# EAGLE design LayerOne_2017 (EAGLE 7.7.0)
Assembly variants: L4

## Sheet 1 of 8
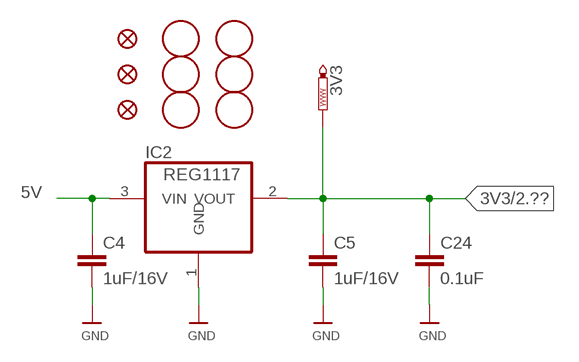
[diagram p0: schematic, sheet 1]

### Parts
3V3  PTR1PAD1-13  [P1-13]
C4  1uF/16V  CAP0805  [0805]
C5  1uF/16V  CAP0805  [0805]
C24  0.1uF  CAP0805  [0805]
FID1  FIDUCIALROUND  [PASS-ROUND]
FID2  FIDUCIALROUND  [PASS-ROUND]
FID3  FIDUCIALROUND  [PASS-ROUND]
IC2  REG1117  [SOT223]
U$3  FIDUCIAL  [FIDUCIAL_1MM]
U$4  FIDUCIAL  [FIDUCIAL_1MM]
U$5  FIDUCIAL  [FIDUCIAL_1MM]
U$7  FIDUCIAL  [FIDUCIAL_1MM]
U$8  FIDUCIAL  [FIDUCIAL_1MM]
U$9  FIDUCIAL  [FIDUCIAL_1MM]

### Nets
3V3: 3V3.TP C5.1 C24.1 IC2.2(VOUT) ; also sheet 2,3,4,5
5V: C4.1 IC2.3(VIN) ; also sheet 2,7,8
GND: C4.2 C5.2 C24.2 IC2.1(GND) ; also sheet 2,3,4,5,6,7,8

## Sheet 2 of 8
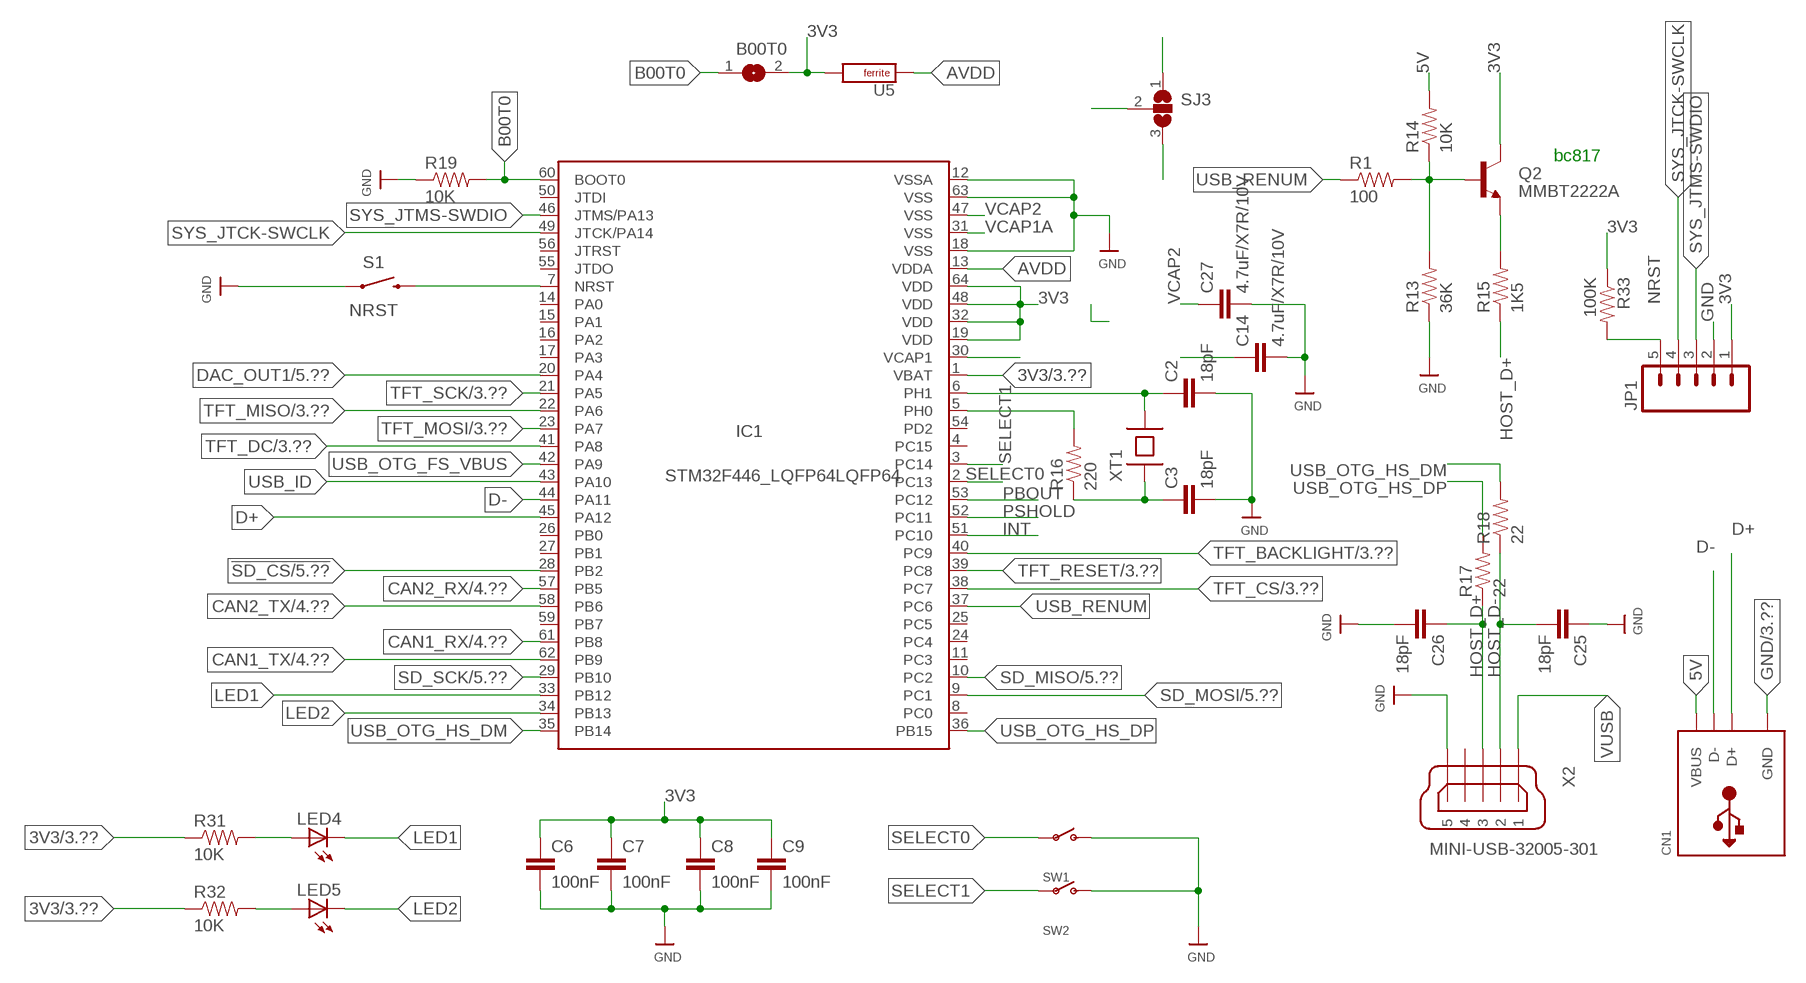
[diagram p1: schematic, sheet 2]

### Parts
B00T0  SJW  [SJW]
C2  18pF  CAP0805  [0805]
C3  18pF  CAP0805  [0805]
C6  100nF  CAP0805  [0805]
C7  100nF  CAP0805  [0805]
C8  100nF  CAP0805  [0805]
C9  100nF  CAP0805  [0805]
C14  4.7uF/X7R/10V  CAP0805  [0805]
C25  18pF  CAP0805  [0805]
C26  18pF  CAP0805  [0805]
C27  4.7uF/X7R/10V  CAP0805  [0805]
CN1  USB_TYPEAPTHFML  [USB_HOST-PTH]
IC1  STM32F446_LQFP64LQFP64  [LQFP64]
JP1  M05PTH  [1X05]
LED4  LEDCHIP-LED0805  [CHIP-LED0805]
LED5  LEDCHIP-LED0805  [CHIP-LED0805]
Q2  MMBT2222A  TRANSISTOR_NPNMMBT2222A  [SOT23]
R1  100  RESISTOR0805-RES  [0805]
R13  36K  RESISTOR0805-RES  [0805]
R14  10K  RESISTOR0805-RES  [0805]
R15  1K5  RESISTOR0805-RES  [0805]
R16  220  RESISTOR0805-RES  [0805]
R17  22  RESISTOR0805-RES  [0805]
R18  22  RESISTOR0805-RES  [0805]
R19  10K  RESISTOR0805-RES  [0805]
R31  10K  RESISTOR0805-RES  [0805]
R32  10K  RESISTOR0805-RES  [0805]
R33  100K  RESISTOR0805-RES  [0805]
S1  SPARKFUN_SWITCH-MOMENTARY-2SMD  [SPARKFUN_TACTILE_SWITCH_SMD]
SJ3  SJ2W  [SJ_2]
SW1  SWITCH_SPST  [SPST_SMT_19192]
SW2  SWITCH_SPST  [SPST_SMT_19192]
U5  FERRITE0805  [RLC_0805]
X2  MINI-USB-32005-301  [32005-301]
XT1  8Mhz/16pF  XTAL-SMD-CITIZEN-CS10  [XTAL-SMD-CITIZEN-CS10]

### Nets
3V3: B00T0.2 C6.1 C7.1 C8.1 C9.1 IC1.1(VBAT) IC1.19(VDD) IC1.32(VDD) IC1.48(VDD) IC1.64(VDD) JP1.1 Q2.3(C) R31.1 R32.1 R33.1 U5.2(B) ; also sheet 1,3,4,5
5V: CN1.VBUS R14.2 ; also sheet 1,7,8
!SD_CS: IC1.28(PB2) ; also sheet 5
AVDD: IC1.13(VDDA) U5.1(A)
B00T0: B00T0.1 IC1.60(BOOT0) R19.2
CAN1_RX: IC1.61(PB8) ; also sheet 4
CAN1_TX: IC1.62(PB9) ; also sheet 4
CAN2_RX: IC1.57(PB5) ; also sheet 4
CAN2_TX: IC1.58(PB6) ; also sheet 4
D+: CN1.D+ IC1.45(PA12)
D-: CN1.D- IC1.44(PA11)
DAC_OUT1: IC1.20(PA4) ; also sheet 5
GND: C2.2 C3.2 C6.2 C7.2 C8.2 C9.2 C14.2 C25.1 C26.2 C27.2 CN1.GND IC1.12(VSSA) IC1.18(VSS) IC1.63(VSS) JP1.2 R13.1 R19.1 S1.1 SW1.C(S) SW2.C(S) X2.5 ; also sheet 1,3,4,5,6,7,8
HOST_D+: C26.1 R15.1 R17.1 X2.3
HOST_D-: C25.2 R18.1 X2.2
INT: IC1.51(PC10) ; also sheet 8
LED1: IC1.33(PB12) LED4.C
LED2: IC1.34(PB13) LED5.C
N$3: Q2.1(B) R1.2 R13.2 R14.1
N$4: Q2.2(E) R15.2
N$10: C2.1 IC1.6(PH1) XT1.B
N$18: C3.1 R16.1 XT1.A
N$19: IC1.5(PH0) R16.2
N$38: LED4.A R31.2
N$39: LED5.A R32.2
NRST: IC1.7(NRST) JP1.5 R33.2 S1.3 ; also sheet 8
PBOUT: IC1.53(PC12) ; also sheet 8
PSHOLD: IC1.52(PC11) ; also sheet 8
SD_MISO: IC1.10(PC2) ; also sheet 5
SD_MOSI: IC1.9(PC1) ; also sheet 5
SD_SCK: IC1.29(PB10) ; also sheet 5
SELECT0: IC1.2(PC13) SW1.B(P)
SELECT1: IC1.3(PC14) SW2.B(P)
SYS_JTCK-SWCLK: IC1.49(JTCK/PA14) JP1.4
SYS_JTMS-SWDIO: IC1.46(JTMS/PA13) JP1.3
TFT_BACKLIGHT: IC1.40(PC9) ; also sheet 3
TFT_CS: IC1.38(PC7) ; also sheet 3
TFT_DC: IC1.41(PA8) ; also sheet 3
TFT_MISO: IC1.22(PA6) ; also sheet 3
TFT_MOSI: IC1.23(PA7) ; also sheet 3
TFT_RESET: IC1.39(PC8) ; also sheet 3
TFT_SCK: IC1.21(PA5) ; also sheet 3
USB_ID: IC1.43(PA10)
USB_OTG_FS_VBUS: IC1.42(PA9)
USB_OTG_HS_DM: IC1.35(PB14) R18.2
USB_OTG_HS_DP: IC1.36(PB15) R17.2
USB_RENUM: IC1.37(PC6) R1.1
VCAP1: IC1.30(VCAP1) SJ3.1
VCAP1A: IC1.31(VSS) SJ3.3
VCAP1C: C14.1 SJ3.2
VCAP2: C27.1 IC1.47(VSS)
VUSB: X2.1 ; also sheet 6
Unconnected: IC1.4(PC15) IC1.8(PC0) IC1.11(PC3) IC1.14(PA0) IC1.15(PA1) IC1.16(PA2) IC1.17(PA3) IC1.24(PC4) IC1.25(PC5) IC1.26(PB0) IC1.27(PB1) IC1.50(JTDI) IC1.54(PD2) IC1.55(JTDO) IC1.56(JTRST) IC1.59(PB7) X2.4

### Notes on the sheet
- bc817

## Sheet 3 of 8
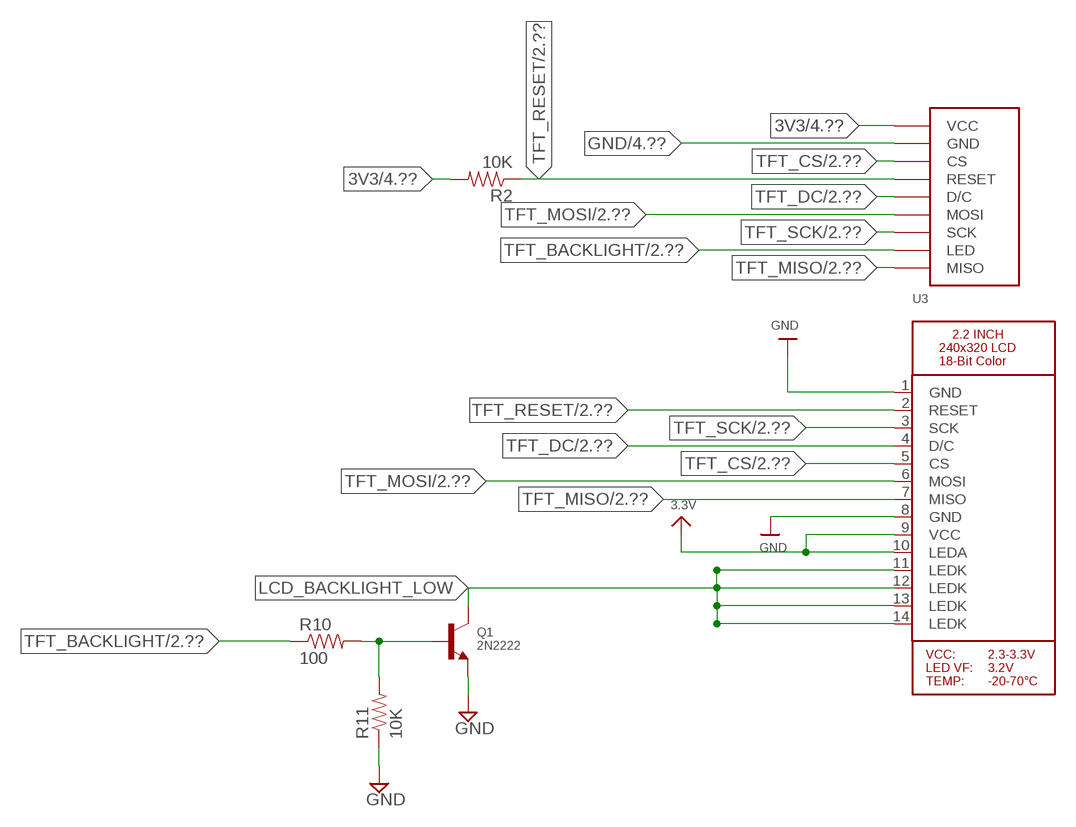
[diagram p2: schematic, sheet 3]

### Parts
J1  SPI_TFT_DISPLAY  [SPI_DISPLAY]
Q1  2N2222  TRANSISTOR_NPNWIDE  [SOT23-WIDE]
R2  10K  RESISTOR0805-RES  [0805]
R10  100  RESISTOR0805-RES  [0805]
R11  10K  RESISTOR0805-RES  [0805]
U3  MICROBUILDER_DISP_LCD_TM022HDH26  [MICROBUILDER_TM022HDH26_2.2IN_LCD]

### Nets
3V3: J1.VCC R2.2 U3.9(VCC) U3.10(LEDA) ; supply symbol labelled 3.3V ; also sheet 1,2,4,5
GND: J1.GND Q1.2(E) R11.1 U3.1(GND) U3.8(GND) ; also sheet 1,2,4,5,6,7,8
LCD_BACKLIGHT_LOW: Q1.3(C) U3.11(LEDK) U3.12(LEDK) U3.13(LEDK) U3.14(LEDK)
N$16: Q1.1(B) R10.2 R11.2
TFT_BACKLIGHT: J1.LED R10.1 ; also sheet 2
TFT_CS: J1.CS U3.5(CS) ; also sheet 2
TFT_DC: J1.D/C U3.4(D/C) ; also sheet 2
TFT_MISO: J1.MISO U3.7(MISO) ; also sheet 2
TFT_MOSI: J1.MOSI U3.6(MOSI) ; also sheet 2
TFT_RESET: J1.RESET R2.1 U3.2(RESET) ; also sheet 2
TFT_SCK: J1.SCK U3.3(SCK) ; also sheet 2

## Sheet 4 of 8
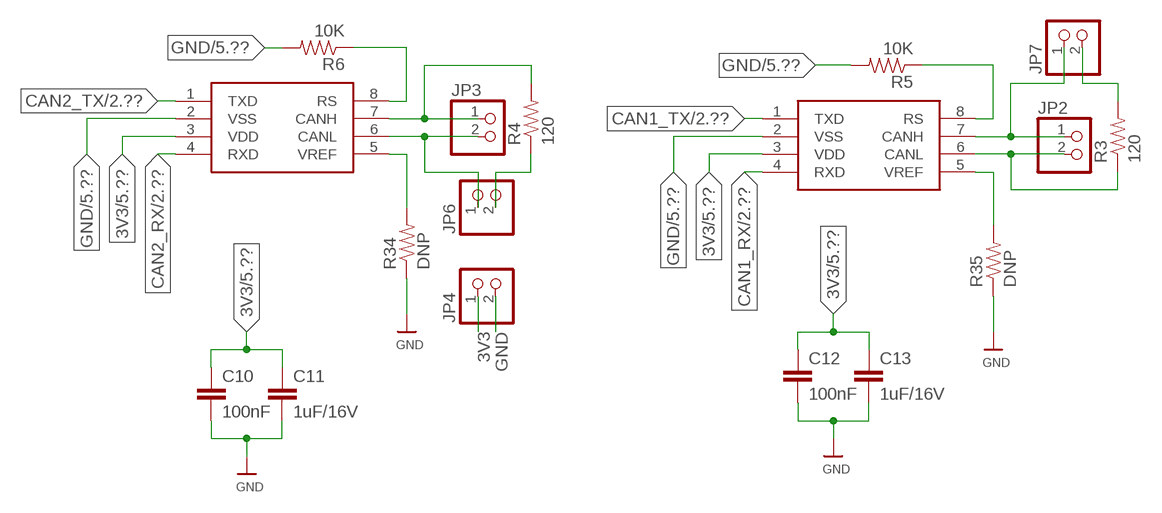
[diagram p3: schematic, sheet 4]

### Parts
C10  100nF  CAP0805  [0805]
C11  1uF/16V  CAP0805  [0805]
C12  100nF  CAP0805  [0805]
C13  1uF/16V  CAP0805  [0805]
JP2  HEADER-1X2  [1X02_OVAL]
JP3  HEADER-1X2  [1X02_OVAL]
JP4  HEADER-1X2  [1X02_OVAL]
JP6  HEADER-1X2  [1X02_OVAL]
JP7  HEADER-1X2  [1X02_OVAL]
R3  120  RESISTOR0805-RES  [0805]
R4  120  RESISTOR0805-RES  [0805]
R5  10K  RESISTOR0805-RES  [0805]
R6  10K  RESISTOR0805-RES  [0805]
R34  DNP  RESISTOR0805-RES  [0805]
R35  DNP  RESISTOR0805-RES  [0805]
U1  SN65HVD235DR  MCP2551  [SO08]
U2  SN65HVD235DR  MCP2551  [SO08]

### Nets
3V3: C10.1 C11.1 C12.1 C13.1 JP4.1 U1.3(VDD) U2.3(VDD) ; also sheet 1,2,3,5
CAN1_RX: U2.4(RXD) ; also sheet 2
CAN1_TX: U2.1(TXD) ; also sheet 2
CAN2_RX: U1.4(RXD) ; also sheet 2
CAN2_TX: U1.1(TXD) ; also sheet 2
CANH1: JP2.1 JP7.1 U2.7(CANH)
CANH2: JP3.1 R4.2 U1.7(CANH)
CANL1: JP2.2 R3.1 U2.6(CANL)
CANL2: JP3.2 JP6.1 U1.6(CANL)
GND: C10.2 C11.2 C12.2 C13.2 JP4.2 R5.2 R6.2 R34.1 R35.1 U1.2(VSS) U2.2(VSS) ; also sheet 1,2,3,5,6,7,8
N$6: JP7.2 R3.2
N$22: JP6.2 R4.1
N$30: R34.2 U1.5(VREF)
N$41: R35.2 U2.5(VREF)
SLOPE1: R5.1 U2.8(RS)
SLOPE2: R6.1 U1.8(RS)

## Sheet 5 of 8
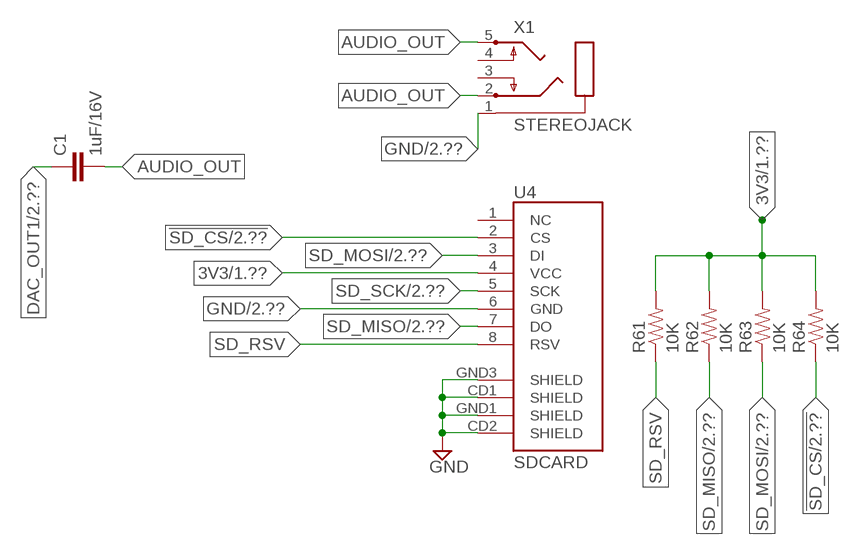
[diagram p4: schematic, sheet 5]

### Parts
C1  1uF/16V  CAP0805  [0805]
R61  10K  RESISTOR0805-RES  [0805]
R62  10K  RESISTOR0805-RES  [0805]
R63  10K  RESISTOR0805-RES  [0805]
R64  10K  RESISTOR0805-RES  [0805]
U4  SDCARD  USD-SOCKETNEW  [MICRO-SD-SOCKET-PP]
X1  STEREOJACK  [STX3100]

### Nets
3V3: R61.2 R62.2 R63.2 R64.2 U4.4(VCC) ; also sheet 1,2,3,4
!SD_CS: R64.1 U4.2(CS) ; also sheet 2
AUDIO_OUT: C1.2 X1.2 X1.5
DAC_OUT1: C1.1 ; also sheet 2
GND: U4.6(GND) U4.CD1(SHIELD) U4.CD2(SHIELD) U4.GND1(SHIELD) U4.GND3(SHIELD) X1.1 ; also sheet 1,2,3,4,6,7,8
SD_MISO: R62.1 U4.7(DO) ; also sheet 2
SD_MOSI: R63.1 U4.3(DI) ; also sheet 2
SD_RSV: R61.1 U4.8(RSV)
SD_SCK: U4.5(SCK) ; also sheet 2
Unconnected: U4.1(NC) X1.3 X1.4

## Sheet 6 of 8
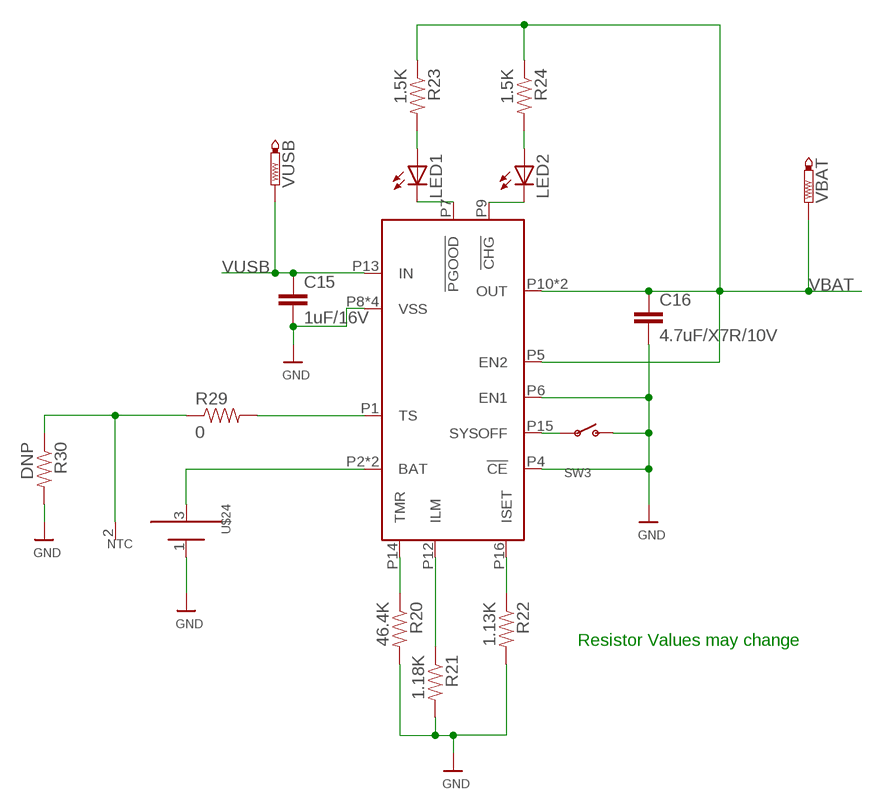
[diagram p5: schematic, sheet 6]

### Parts
C15  1uF/16V  CAP0805  [0805]
C16  4.7uF/X7R/10V  CAP0805  [0805]
LED1  LEDCHIPLED_0603  [CHIPLED_0603]
LED2  LEDCHIPLED_0603  [CHIPLED_0603]
R20  46.4K  RESISTOR0805-RES  [0805]
R21  1.18K  RESISTOR0805-RES  [0805]
R22  1.13K  RESISTOR0805-RES  [0805]
R23  1.5K  RESISTOR0805-RES  [0805]
R24  1.5K  RESISTOR0805-RES  [0805]
R29  0  RESISTOR0805-RES  [0805]
R30  DNP  RESISTOR0805-RES  [0805]
SW3  SWITCH_SPST  [SPST_SMT_19192]
U$23  TI-BQ2407XBQ24075  [QFN16]
U$24  BATT  [BATT]
VBAT  PTR1PAD1-13  [P1-13]
VUSB  PTR1PAD1-13  [P1-13]

### Nets
GND: C15.2 C16.2 R20.2 R21.2 R22.2 R30.2 SW3.C(S) U$23.P4(!CE) U$23.P6(EN1) U$23.P8(VSS) U$23.XPAD@1(VSS) U$23.XPAD@2(VSS) U$23.XPAD@3(VSS) U$24.1(NEG) ; also sheet 1,2,3,4,5,7,8
N$17: R29.2 U$23.P1(TS)
N$24: U$23.P2(BAT) U$23.P3(BAT) U$24.3(POS)
N$25: LED1.C U$23.P7(!PGOOD)
N$29: LED1.A R23.2
N$31: SW3.B(P) U$23.P15(SYSOFF)
N$32: R20.1 U$23.P14(TMR)
N$33: R21.1 U$23.P12(ILM)
N$34: R22.1 U$23.P16(ISET)
N$35: LED2.C U$23.P9(!CHG)
N$36: LED2.A R24.2
N$37: R29.1 R30.1 U$24.2(NTC)
VBAT: C16.1 R23.1 R24.1 U$23.P5(EN2) U$23.P10(OUT) U$23.P11(OUT) VBAT.TP ; also sheet 7,8
VUSB: C15.1 U$23.P13(IN) VUSB.TP ; also sheet 2

### Notes on the sheet
- Resistor Values may change

## Sheet 7 of 8
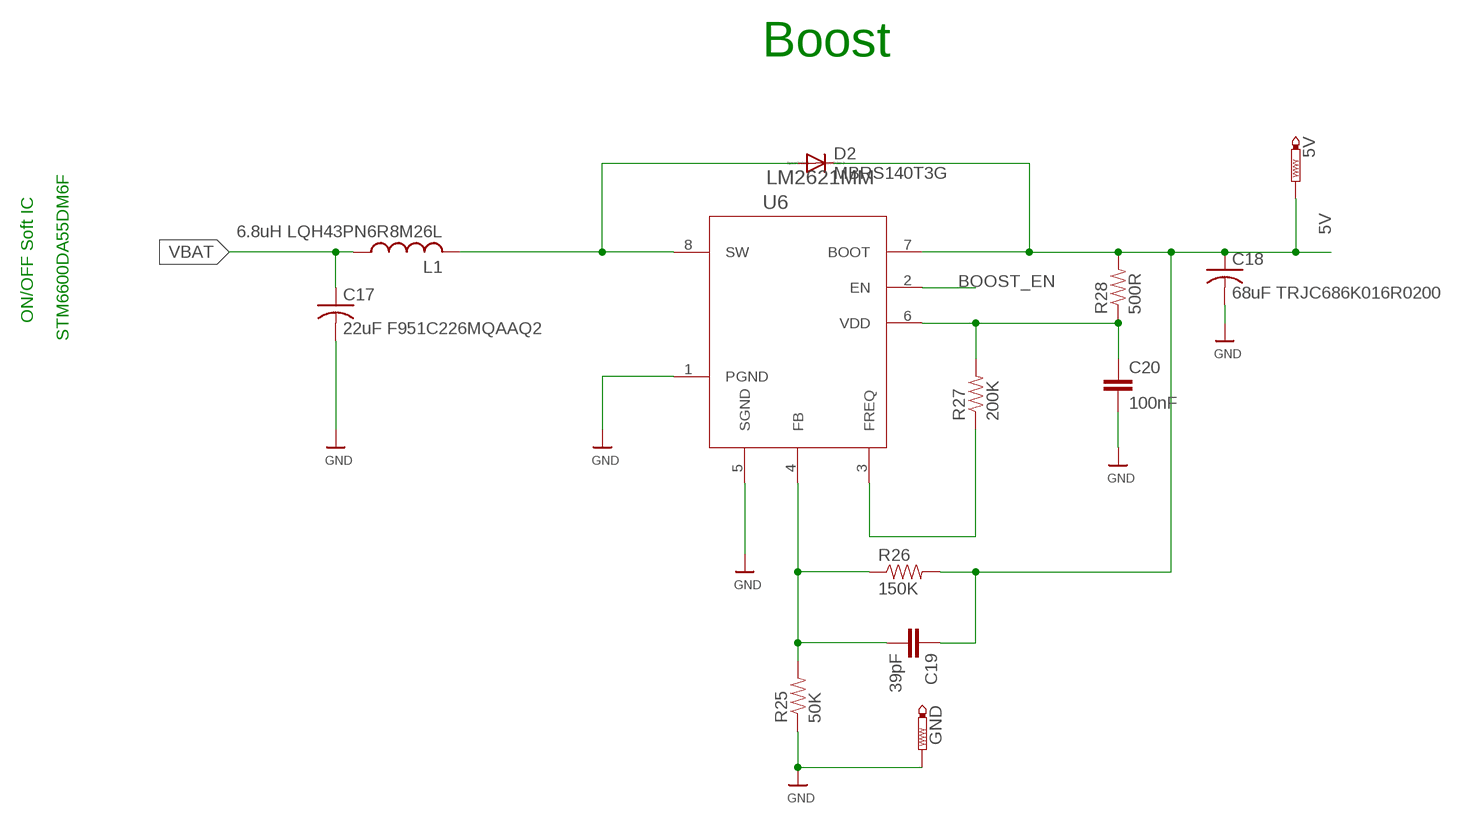
[diagram p6: schematic, sheet 7]

### Parts
5V  PTR1PAD1-13  [P1-13]
C17  22uF F951C226MQAAQ2  C-USC1206  [C1206]
C18  68uF TRJC686K016R0200  C-USC3225  [C3225]
C19  39pF  CAP0805  [0805]
C20  100nF  CAP0805  [0805]
D2  MBRS140T3G  DIODE-SMB  [SMB]
GND  PTR1PAD1-13  [P1-13]
L1  6.8uH LQH43PN6R8M26L  L-USL1812  [L1812]
R25  50K  RESISTOR0805-RES  [0805]
R26  150K  RESISTOR0805-RES  [0805]
R27  200K  RESISTOR0805-RES  [0805]
R28  500R  RESISTOR0805-RES  [0805]
U6  LM2621MM  [SOP65P490X110-8N]

### Nets
5V: 5V.TP C18.1 C19.1 D2.C R26.2 R28.2 U6.7(BOOT) ; also sheet 1,2,8
BOOST_EN: U6.2(EN) ; also sheet 8
FB: C19.2 R25.2 R26.1 U6.4(FB)
FREQ: R27.1 U6.3(FREQ)
GND: C17.2 C18.2 C20.2 GND.TP R25.1 U6.1(PGND) U6.5(SGND) ; also sheet 1,2,3,4,5,6,8
SW: D2.A L1.2 U6.8(SW)
VBAT: C17.1 L1.1 ; also sheet 6,8
VDD: C20.1 R27.2 R28.1 U6.6(VDD)

### Notes on the sheet
- Boost
- ON/OFF Soft IC
- STM6600DA55DM6F

## Sheet 8 of 8
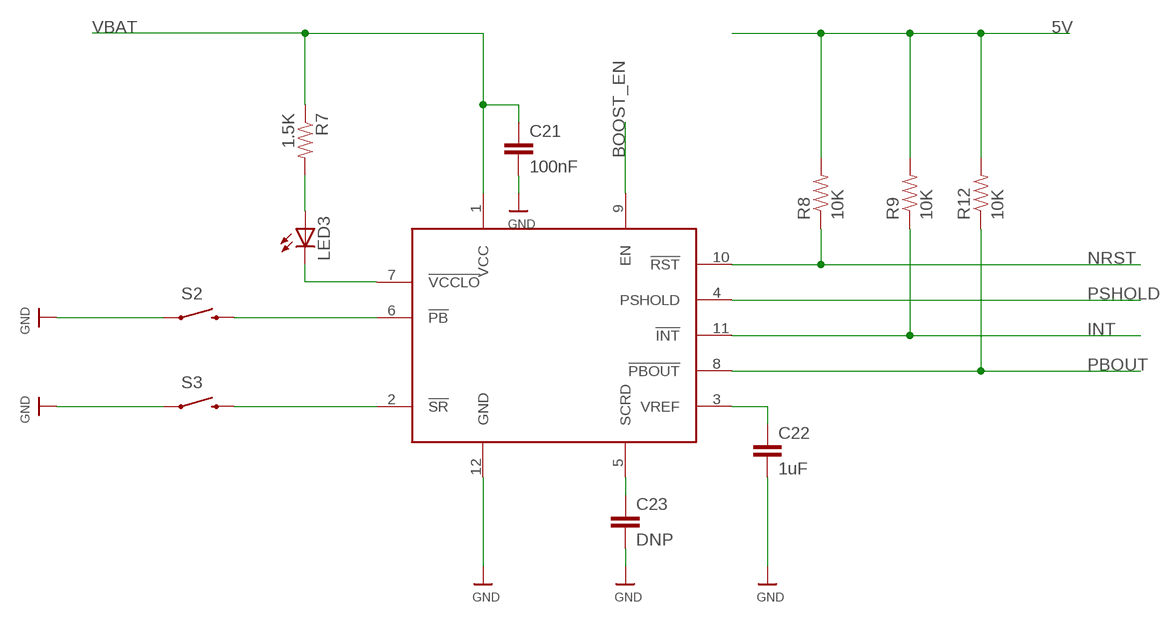
[diagram p7: schematic, sheet 8]

### Parts
C21  100nF  CAP0805  [0805]
C22  1uF  CAP0805  [0805]
C23  DNP  CAP0805  [0805]
LED3  LEDCHIPLED_0603  [CHIPLED_0603]
R7  1.5K  RESISTOR0805-RES  [0805]
R8  10K  RESISTOR0805-RES  [0805]
R9  10K  RESISTOR0805-RES  [0805]
R12  10K  RESISTOR0805-RES  [0805]
S2  SPARKFUN_SWITCH-MOMENTARY-2SMD  [SPARKFUN_TACTILE_SWITCH_SMD]
S3  SPARKFUN_SWITCH-MOMENTARY-2SMD  [SPARKFUN_TACTILE_SWITCH_SMD]
U$29  STM6600  [TDFN12_STM]

### Nets
5V: R8.2 R9.2 R12.2 ; also sheet 1,2,7
BOOST_EN: U$29.9(EN) ; also sheet 7
GND: C21.2 C22.2 C23.2 S2.1 S3.1 U$29.12(GND) ; also sheet 1,2,3,4,5,6,7
INT: R9.1 U$29.11(!INT) ; also sheet 2
N$1: S2.3 U$29.6(!PB)
N$13: S3.3 U$29.2(!SR)
N$14: LED3.C U$29.7(!VCCLO)
N$15: LED3.A R7.2
N$42: C22.1 U$29.3(VREF)
N$45: C23.1 U$29.5(SCRD)
NRST: R8.1 U$29.10(!RST) ; also sheet 2
PBOUT: R12.1 U$29.8(!PBOUT) ; also sheet 2
PSHOLD: U$29.4(PSHOLD) ; also sheet 2
VBAT: C21.1 R7.1 U$29.1(VCC) ; also sheet 6,7

## Library data of the parts
3V3 5V GND VBAT VUSB = testpad:PTR1: TEST PIN
B00T0 = jumper:SJ: SMD solder JUMPER
C1-C9 C14-C16 C19-C27 = SparkFun-Passives:CAP: Capacitor Standard 0603 ceramic capacitor, and 0.1" leaded capacitor.
C10-C13 = SparkFun-Capacitors:CAP: Capacitor Standard 0603 ceramic capacitor, and 0.1" leaded capacitor.
C17 C18 = rcl:C-US: CAPACITOR, American symbol
CN1 = microbuilder:USB_TYPEA: USB - Type A Connectors Male types stick out and are inserted into a PC or matching females parts (these are the connectors used on USB Memory Sticks, etc.). Female parts are generally used for USB Host and accept a male-type connector. SMT Male - 4UCON: 10017 PTH Female - Digikey: 609-1045-ND, 4UCon: 05241
D2 = diode:DIODE-: DIODE
FID1-FID3 = microbuilder:FIDUCIAL: Fiducial Alignment Points Various fiducial points for machine vision alignment.
IC1 = stm32f466re:STM32F446_LQFP64: STM32F446_LQFP64 edit this description Auto generated by make-symbol-device-package-bsdl.ulp Rev. 44 Source: STM32F446_LQFP64.bsd
IC2 = burr-brown:REG1117: 800mA and 1A Low Dropout (LDO) Positive Regulator 1.8V, 2.5V, 2.85V, 3.3V, 5V, and Adj; MPN: REG1117; OC_FARNELL: 1097566; OC_NEWARK: 14P6981
J1 = kanflo:SPI_TFT_DISPLAY: SPI TFT Display Connector for the cheap 2.2"/2.4" Serial SPI TFT displays found on eBay.
JP1 = SparkFun:M05: Header 5 Standard 5-pin 0.1" header. Use with straight break away headers (SKU : PRT-00116), right angle break away headers (PRT-00553), swiss pins (PRT-00743), machine pins (PRT-00117), and female headers (PRT-00115). Molex polarized connector foot print use with SKU : PRT-08230 with associated crimp pins and housings.
JP2-JP4 JP6 JP7 = microbuilder:HEADER-1X2: PIN HEADER
L1 = rcl:L-US: INDUCTOR, American symbol
LED1-LED3 = adafruit:LED: LED
LED4 LED5 = led:LED: LED
Q1 = microbuilder:TRANSISTOR_NPN: NPN Transistor Transistor (NPN) 500mA 45V - BC817 [Digikey: 568-1631-1-ND] Transistor (NPN) 500mA 45V - BC817,215 [Mouser: 771-BC817-T/R] SOT23-R - SOT23 footprint optimised for use with solder paste and reflow ovens. SOT23-W - SOT23 footprint optimised for hand-soldering (larger pads).
Q2 = SparkFun-DiscreteSemi:TRANSISTOR_NPN: Generic NPN BJT MMBT2222A - TRANS-08049 (SOT-23, 1A 40V) MPSA42 - TRANS-09116 (SOT-23, 500mA 300V) MMBT5088LT1G - TRANS-11160 (SOT-23, 50 mA 30V); PROD_ID: TRANS-08049
R1 R8-R16 R19 R25-R28 R31-R33 = SparkFun-Passives:RESISTOR: Resistor Basic schematic elements and footprints for 0603, 1206, and PTH resistors.
R2-R7 R17 R18 R20-R24 R29 R30 R34 R35 R61-R64 = SparkFun-Passives:RESISTOR: Resistor Basic schematic elements and footprints for 0603, 1206, and PTH resistors.; DIGIKEY: RMCF0603JT10K0CT-ND; MPN: RMCF0603JT10K0; OC_NEWARK: unknown; PARTNO: RMCF0603JT10K0
S1-S3 = Nullspace:SPARKFUN_SWITCH-MOMENTARY-2
SJ3 = jumper:SJ2W: SMD solder JUMPER
SW1-SW3 = microbuilder:SWITCH_SPST: Switch - SPST 4UCon 19192 (6.7x2.6mm SMT)
U1 U2 = SparkFun:MCP2551
U3 = LayerOne_2017:MICROBUILDER_DISP_LCD_TM022HDH26: TM022HDH26 2.2 Inch 240x320 18-bit LCD - ILI9340C Controller
U4 = STM32-PROX:USD-SOCKET: microSD Socket Push-push type uSD socket. Schematic element and footprint production proven. Spark Fun Electronics SKU : PRT-00127. tDoc lines correctly indicate media card edge positions when inserting (unlocked, locked, depressed).; OC_NEWARK: unknown; PARTNO: *
U5 = STM32-PROX:FERRITE
U6 = LM2621MM:LM2621MM: DC/DC Boost Converter; AVAILABILITY: Good; DESCRIPTION: Conv DC-DC Single Step Up 1.2V to 14V 8-Pin MSOP T/R; MF: Texas Instruments; MP: LM2621MM/NOPB; PACKAGE: MSOP-8 Texas Instruments; PRICE: 1.33 USD
U$3-U$5 U$7-U$9 = adafruit:FIDUCIAL: For use by pick and place machines to calibrate the vision/machine, 1mm By microbuilder.eu
U$23 = LayerOne_2017:TI-BQ2407X
U$24 = STM32-PROX:BATT
U$29 = LayerOne_2017:STM6600
X1 = adafruit:STEREOJACK: MIC/HEADPHONE JACK Stereo jack with two switches. Kycon STX3100, CUI SJ1-3555NG and/or 4UCon 05544
X2 = con-cypressindustries:MINI-USB-: MINI USB-B Conector Source: www.cypressindustries.com; OC_FARNELL: unknown; OC_NEWARK: unknown
XT1 = STM32-PROX:XTAL-SMD-CITIZEN-CS10

## Net classes
0 default: width 0.254 mm
1 power1: width 0.305 mm
2 power: width 0.254 mm, drill 0.254 mm, clearance 0.178 mm
3 signals: width 0.356 mm

## Board
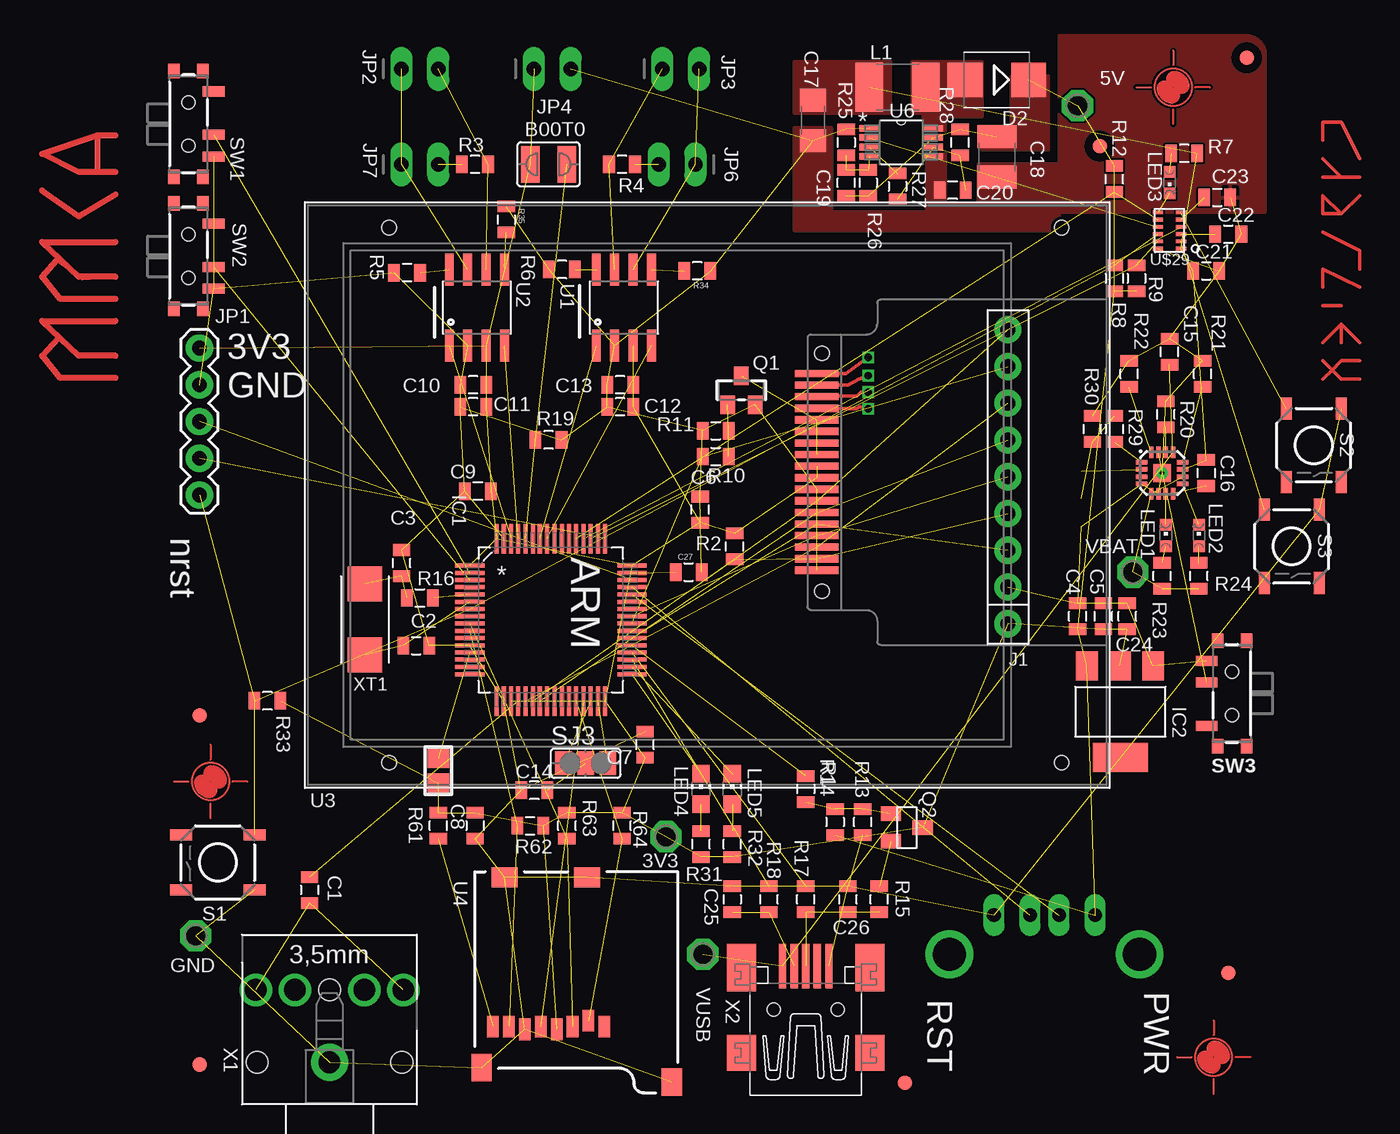
[diagram p8: board, top side]
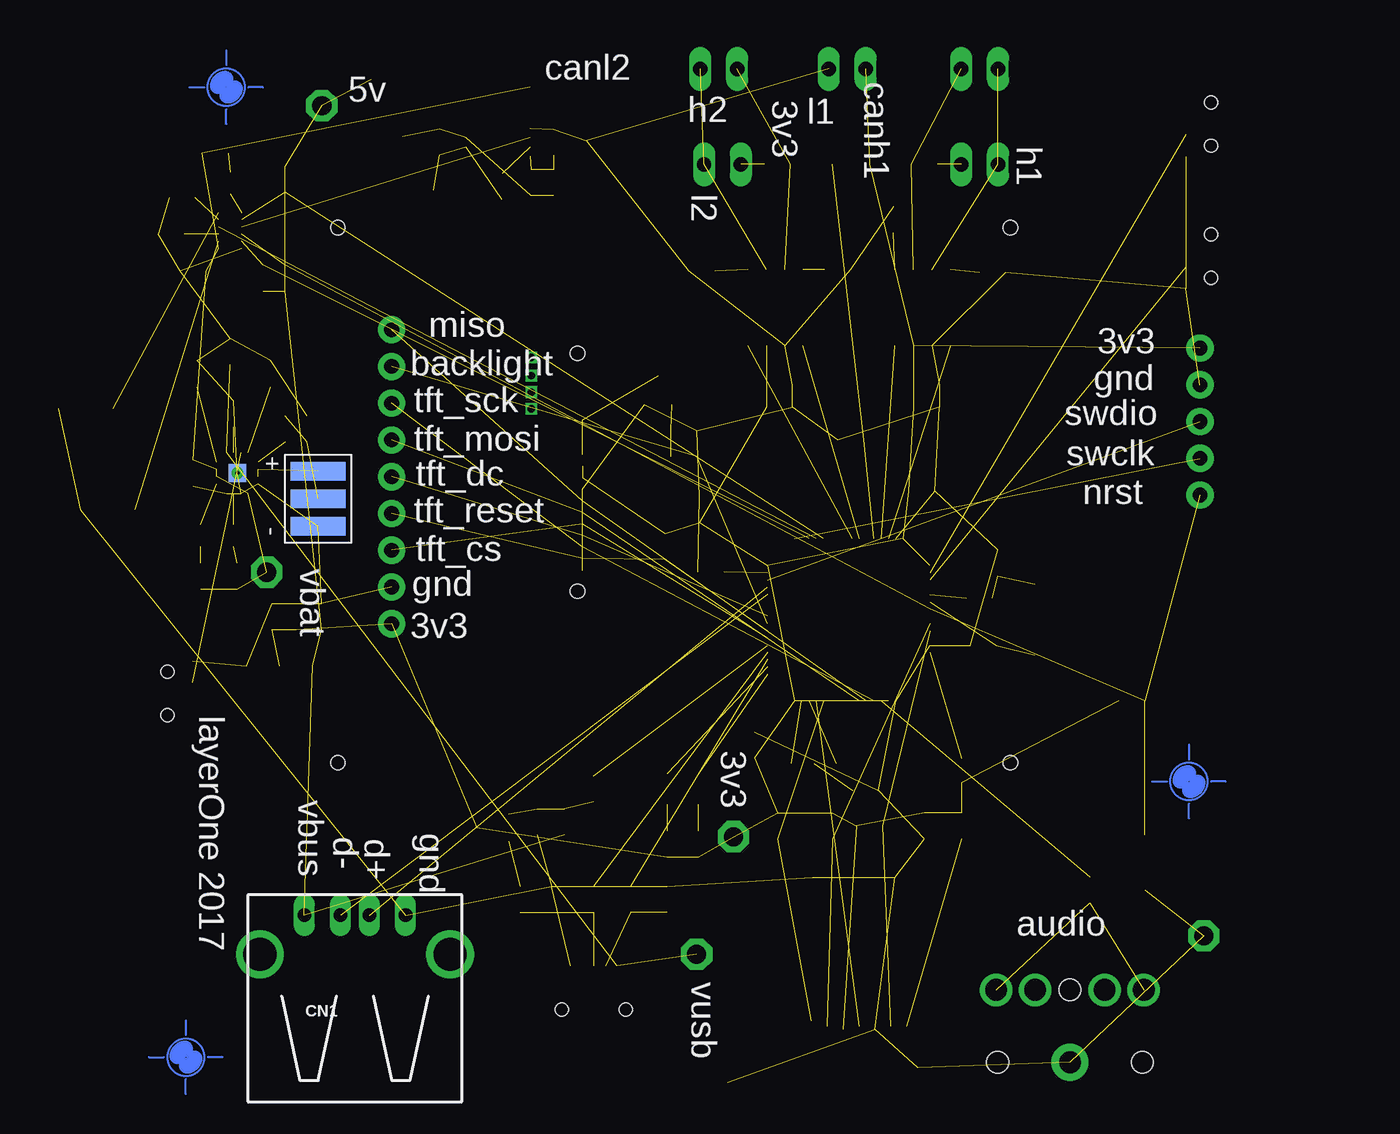
[diagram p9: board, bottom side, seen from below]

No outline drawn. Coordinates in mm, seen from the top.
Copper layers (1*16): Top 0.035mm / dielectric 1.5mm / Bottom 0.035mm
Design rules "ITEADstudio_DRC": minimum track width 6mil, minimum drill 12mil, track to track 6mil, track to pad 6mil, pad to pad 6mil, via to via 6mil, smd to smd 0mil, copper to edge 10mil, drill to drill 10mil, minimum pad ring 10mil, minimum via ring 6mil, stop-mask expansion 2mil, vias tented up to drill 100mil, thermal gap 10mil
tKeepout: 1 lines
tRestrict: 7 lines

### Footprints (pad centres in the part's own frame; a part is rotated, then mirrored left to right if it is on the bottom)
P1-13 = drill 1.321 pad 2.159 octagon: TP 0,0
SJW = smd 1.27 x 2.54: 1 -1.27,0; 2 1.27,0
0805 = smd 0.8 x 1.2: 1 -0.9,0; 2 0.9,0
C1206 = smd 1.6 x 1.8: 1 -1.4,0; 2 1.4,0
C3225 = smd 1.6 x 2.7: 1 -1.4,0; 2 1.4,0
USB_HOST-PTH = drill 0.95 long: D+ 1,6.52; D- -1,6.52; GND 3.5,6.52; VBUS -3.5,6.52 | drill 2.3 pad 2.9: S1 -6.57,3.81; S2 6.57,3.81
SMB = smd 2.4 x 2.4: A 2.2,0; C -2.2,0
LQFP64 = smd 2.032 x 0.279: 1 -5.613,3.759; 2 -5.613,3.251; 3 -5.613,2.743; 4 -5.613,2.261; 5 -5.613,1.753; 6 -5.613,1.245; 7 -5.613,0.762; 8 -5.613,0.254; 9 -5.613,-0.254; 10 -5.613,-0.762; 11 -5.613,-1.245; 12 -5.613,-1.753; 13 -5.613,-2.261; 14 -5.613,-2.743; 15 -5.613,-3.251; 16 -5.613,-3.759; 33 5.613,-3.759; 34 5.613,-3.251; 35 5.613,-2.743; 36 5.613,-2.261; 37 5.613,-1.753; 38 5.613,-1.245; 39 5.613,-0.762; 40 5.613,-0.254; 41 5.613,0.254; 42 5.613,0.762; 43 5.613,1.245; 44 5.613,1.753; 45 5.613,2.261; 46 5.613,2.743; 47 5.613,3.251; 48 5.613,3.759 | smd 0.279 x 2.032: 17 -3.759,-5.613; 18 -3.251,-5.613; 19 -2.743,-5.613; 20 -2.261,-5.613; 21 -1.753,-5.613; 22 -1.245,-5.613; 23 -0.762,-5.613; 24 -0.254,-5.613; 25 0.254,-5.613; 26 0.762,-5.613; 27 1.245,-5.613; 28 1.753,-5.613; 29 2.261,-5.613; 30 2.743,-5.613; 31 3.251,-5.613; 32 3.759,-5.613; 49 3.759,5.613; 50 3.251,5.613; 51 2.743,5.613; 52 2.261,5.613; 53 1.753,5.613; 54 1.245,5.613; 55 0.762,5.613; 56 0.254,5.613; 57 -0.254,5.613; 58 -0.762,5.613; 59 -1.245,5.613; 60 -1.753,5.613; 61 -2.261,5.613; 62 -2.743,5.613; 63 -3.251,5.613; 64 -3.759,5.613
SOT223 = smd 1.499 x 2.007: 1 -2.261,-3.15; 2 0.025,-3.15; 3 2.311,-3.15 | smd 3.81 x 2.007: 4 0,3.15
SPI_DISPLAY = drill 1.016 pad 1.88: CS -5.08,3.81; D/C -5.08,-1.27; GND -5.08,6.35; LED -5.08,-8.89; MISO -5.08,-11.43; MOSI -5.08,-3.81; RESET -5.08,1.27; SCK -5.08,-6.35; VCC -5.08,8.89
1X05 = drill 1.016 pad 1.88: 1 0,0; 2 2.54,0; 3 5.08,0; 4 7.62,0; 5 10.16,0
1X02_OVAL = drill 1 long: 1 -1.27,0; 2 1.27,0
L1812 = smd 1.9 x 3.4: 1 -1.95,0; 2 1.95,0
CHIPLED_0603 = smd 0.8 x 0.8: A 0,-0.75; C 0,0.75
CHIP-LED0805 = smd 1.2 x 1.2: A 0,-1.05; C 0,1.05
SOT23-WIDE = smd 1 x 1.27: 1 -0.95,-1; 2 0.95,-1; 3 0,1
SOT23 = smd 1 x 1.4: 1 -0.95,-1.1; 2 0.95,-1.1; 3 0,1.1
SPARKFUN_TACTILE_SWITCH_SMD = smd 1.524 x 0.762: 1 -2.54,1.905; 2 2.54,1.905; 3 -2.54,-1.905; 4 2.54,-1.905
SJ_2 = smd 1.168 x 1.6: 1 -1.524,0; 2 0,0; 3 1.524,0
SPST_SMT_19192 = smd 0.7 x 1.5: A -2.25,1.75; B 0.75,1.75; C 2.25,1.75 | smd 1 x 0.8: GND1 -3.65,1; GND2 -3.65,-1; GND3 3.65,1; GND4 3.65,-1 | hole 0.9: -1.5,0; 1.5,0
SO08 = smd 0.61 x 2.21: 1 -1.905,-2.616; 2 -0.635,-2.616; 3 0.635,-2.616; 4 1.905,-2.616; 5 1.905,2.616; 6 0.635,2.616; 7 -0.635,2.616; 8 -1.905,2.616
MICROBUILDER_TM022HDH26_2.2IN_LCD = smd 0.5 x 3: 1 -5.2,-9.66; 2 -4.4,-9.66; 3 -3.6,-9.66; 4 -2.8,-9.66; 5 -2,-9.66; 6 -1.2,-9.66; 7 -0.4,-9.66; 8 0.4,-9.66; 9 1.2,-9.66; 10 2,-9.66; 11 2.8,-9.66; 12 3.6,-9.66; 13 4.4,-9.66; 14 5.2,-9.66; 15 6,-9.66; 16 6.8,-9.66; 17 7.6,-9.66; 18 8.4,-9.66 | hole 1: -6.65,-10.01; 9.8,-10.01; 18.5,19.92; -18.5,19.92; -18.5,-26.58; 18.5,-26.58
MICRO-SD-SOCKET-PP = smd 0.8 x 1.5: 1 -8.94,10.7; 2 -7.84,10.3; 3 -6.74,10.7; 4 -5.64,10.9; 5 -4.54,10.7; 6 -3.44,10.9; 7 -2.34,10.7; 8 -1.24,10.7 | smd 1.8 x 1.4: CD1 -2.05,0.4; CD2 -7.75,0.4 | smd 1.4 x 1.9: GND1 -13.6,14.55; GND3 -0.45,13.55
RLC_0805 = smd 1.3 x 1.5: 1 -0.85,0; 2 0.85,0
SOP65P490X110-8N = smd 1.372 x 0.457: 1 -2.21,0.965; 2 -2.21,0.33; 3 -2.21,-0.33; 4 -2.21,-0.965; 5 2.21,-0.965; 6 2.21,-0.33; 7 2.21,0.33; 8 2.21,0.965
FIDUCIAL_1MM = smd 1 x 1: 1 0,0
QFN16 = smd 0.8 x 0.3: P1 -1.425,0.75; P2 -1.425,0.25; P3 -1.425,-0.25; P4 -1.425,-0.75; P9 1.425,-0.75; P10 1.425,-0.25; P11 1.425,0.25; P12 1.425,0.75 | smd 0.3 x 0.8: P5 -0.75,-1.425; P6 -0.25,-1.425; P7 0.25,-1.425; P8 0.75,-1.425; P13 0.75,1.425; P14 0.25,1.425; P15 -0.25,1.425; P16 -0.75,1.425 | smd 1.22 x 1.22: XPAD@1 0,0 | smd 1.22 x 1.22 bottom: XPAD@2 0,0 | drill 0.305: XPAD@3 0,0
BATT = smd 1.27 x 3.81: 1 -1.905,0; 2 0,0; 3 1.905,0
TDFN12_STM = smd 0.7 x 0.25: 1 -0.8,1.25; 2 -0.8,0.75; 3 -0.8,0.25; 4 -0.8,-0.25; 5 -0.8,-0.75; 6 -0.8,-1.25; 7 0.8,-1.25; 8 0.8,-0.75; 9 0.8,-0.25; 10 0.8,0.25; 11 0.8,0.75; 12 0.8,1.25
STX3100 = drill 1.5 pad 2.54: 1 2.7,-0.1 | drill 1.5: 2 7.7,5; 3 7.7,2.3; 4 7.7,-2.5; 5 7.7,-5.2 | hole 1.5: 2.7,4.9; 2.7,-5.1; 7.7,-0.1
32005-301 = smd 3.1 x 0.5: 1 3,1.6; 2 3,0.8; 3 3,0; 4 3,-0.8; 5 3,-1.6 | smd 2.5 x 2: M1 -3,-4.45; M2 -3,4.45 | smd 3.3 x 2: M3 2.9,4.45; M4 2.9,-4.45 | hole 0.9: 0,2.2; 0,-2.2
XTAL-SMD-CITIZEN-CS10 = smd 2.4 x 2.4: A -0.2,0; B 4.7,0

### Placement (x,y rotation side)
3V3  44.8,-60.71 0 top
5V  73.25,-10.17 0 top
B00T0  36.67,-14.23 180 top
C1  20.16,-64.39 270 top
C2  27.53,-47.5 0 top
C3  26.51,-41.79 90 top
C4  73.25,-45.47 90 top
C5  75.02,-45.47 90 top
C6  47.15,-38.09 90 top
C7  43.34,-54.35 90 top
C8  31.59,-59.95 270 top
C9  31.78,-36.82 180 top
C10  31.46,-29.47 180 top
C11  31.46,-30.99 180 top
C12  41.62,-30.99 180 top
C13  41.62,-29.47 180 top
C14  35.68,-57.5 180 top
C15  79.6,-27.18 90 top
C16  82.14,-35.57 270 top
C17  54.96,-11.18 270 top
C18  67.66,-13.72 270 top
C19  57.24,-15.5 90 top
C20  64.61,-16.01 180 top
C21  82.14,-21.6 0 top
C22  83.66,-19.06 0 top
C23  82.9,-16.52 0 top
C24  100nF  [0805]  76.67,-45.47 90 top
C25  49.37,-65.03 270 top
C26  57.37,-65.03 90 top
C27  46.35,-42.42 0 top
CN1  70.96,-72.65 0 bottom
D2  67.66,-8.39 180 top
FID1  13.3,-56.9 0 top
FID2  79.85,-8.9 0 top
FID3  82.64,-75.95 0 top
GND  12.29,-67.57 0 top
IC1  36.83,-45.72 0 top
IC2  76.2,-52.07 180 top
J1  63.34,-37.09 180 top
JP1  12.54,-26.93 270 top
JP2  27.78,-7.63 0 top
JP3  45.81,-7.63 0 top
JP4  36.92,-7.63 0 top
JP6  45.56,-14.23 180 top
JP7  27.78,-14.23 0 top
L1  60.8,-8.9 0 top
LED1  79.34,-39.88 0 top
LED2  81.63,-39.88 0 top
LED3  79.6,-15.5 180 top
LED4  47.21,-57.41 0 top
LED5  49.37,-57.41 0 top
Q1  50.01,-29.85 0 top
Q2  61.44,-60.08 270 top
R1  54.45,-57.41 270 top
R2  49.53,-40.64 90 top
R3  31.59,-14.23 180 top
R4  41.75,-14.23 180 top
R5  26.89,-21.72 180 top
R6  37.6,-21.5 180 top
R7  80.61,-13.47 180 top
R8  75.79,-22.1 270 top
R9  77.31,-22.1 270 top
R10  48.23,-34.42 0 top
R11  48.23,-32.65 0 top
R12  75.79,-15.25 90 top
R13  58.39,-59.7 90 top
R14  56.48,-59.7 270 top
R15  59.53,-65.03 90 top
R16  27.78,-44.2 0 top
R17  54.45,-65.03 90 top
R18  51.91,-65.03 90 top
R19  36.67,-33.28 180 top
R20  79.34,-31.5 90 top
R21  81.88,-28.71 90 top
R22  76.8,-28.71 90 top
R23  79.09,-42.68 90 top
R24  81.63,-42.68 90 top
R25  57.24,-12.71 270 top
R26  58.77,-15.5 270 top
R27  60.8,-15.75 270 top
R28  65.12,-12.71 90 top
R29  75.79,-32.52 270 top
R30  74.26,-32.52 90 top
R31  47.21,-61.22 90 top
R32  49.37,-61.22 90 top
R33  10K  [0805]  17.24,-51.31 180 top
R34  46.96,-21.6 180 top
R35  33.75,-18.04 270 top
R61  29.05,-59.95 90 top
R62  35.4,-59.95 0 top
R63  37.94,-59.95 90 top
R64  41.75,-59.95 90 top
S1  13.81,-62.49 180 top
S2  89.57,-33.65 270 top
S3  88.04,-40.63 270 top
SJ3  39.24,-55.63 0 top
SW1  11.78,-11.44 270 top
SW2  11.78,-20.58 270 top
SW3  83.91,-50.81 90 top
U1  41.88,-24.14 0 top
U2  31.72,-24.14 0 top
U3  45.56,-37.09 90 top
U4  31.59,-63.12 180 top
U5  29.05,-56.14 270 top
U6  61.05,-12.71 0 top
U$3  12.54,-52.33 0 top
U$4  61.31,-77.73 0 top
U$5  83.66,-70.11 0 top
U$7  84.93,-6.86 0 top
U$8  74.77,-12.96 0 top
U$9  12.54,-76.46 0 top
U$23  79.09,-35.57 0 top
U$24  73.5,-37.34 90 bottom
U$29  79.6,-18.8 180 top
VBAT  77.06,-42.42 0 top
VUSB  47.34,-68.84 0 top
X1  21.43,-79 90 top
X2  54.45,-72.65 90 top
XT1  23.97,-43.44 270 top

### Tracks (layer width: path | path; a pad name or v marks a point on that pad's centre or on a via)
3V3  (35 unrouted)
5V  (12 unrouted)
  pour Top (no thermals): 66.64,-13.21 71.21,-13.21 71.21,-8.13 68.67,-8.13 68.67,-11.69
!SD_CS  (2 unrouted)
AUDIO_OUT  (2 unrouted)
AVDD  (1 unrouted)
B00T0  (2 unrouted)
BOOST_EN  (1 unrouted)
CAN1_RX  (1 unrouted)
CAN1_TX  (1 unrouted)
CAN2_RX  (1 unrouted)
CAN2_TX  (1 unrouted)
CANH1  (2 unrouted)
CANH2  (2 unrouted)
CANL1  (2 unrouted)
CANL2  (2 unrouted)
D+  (1 unrouted)
D-  (1 unrouted)
DAC_OUT1  (1 unrouted)
FB  (3 unrouted)
FREQ  (1 unrouted)
GND  (67 unrouted)
  pour Top (no thermals): 62.83,-13.47 62.83,-17.53 56.23,-17.53 56.23,-11.69 53.69,-11.69 53.69,-18.8 71.98,-18.8 71.98,-14.23 66.39,-14.23 66.39,-17.02 64.1,-17.02 64.1,-13.47
  pour Top: 71.98,-5.34 71.98,-17.53 86.2,-17.53 86.2,-6.61 arc90 84.93,-5.34
HOST_D+  (3 unrouted)
HOST_D-  (2 unrouted)
INT  (2 unrouted)
LCD_BACKLIGHT_LOW  (4 unrouted)
LED1  (1 unrouted)
LED2  (1 unrouted)
N$1  (1 unrouted)
N$3  (3 unrouted)
N$4  (1 unrouted)
N$5
  Top 0.254: 92.74,-15.11 91.47,-15.11 | 90.2,-13.84 91.47,-15.11 | 91.47,-15.11 90.2,-15.11
N$6  (1 unrouted)
N$7
  Top 0.254: 91.47,-17.65 90.2,-17.65 90.2,-16.38 91.47,-17.65 | 91.47,-17.65 92.74,-16.38
N$8
  Top 0.254: 92.74,-13.84 91.47,-11.3 90.2,-11.3 90.2,-12.57
N$9
  Top 0.254: 90.2,-18.92 92.74,-20.19 92.74,-21.46
N$10  (2 unrouted)
N$11
  Top 0.254: 92.74,-22.73 90.2,-21.46 90.2,-22.73
N$12
  Top 0.254: 91.47,-24 90.2,-24
N$13  (1 unrouted)
N$14  (1 unrouted)
N$15  (1 unrouted)
N$16  (2 unrouted)
N$17  (1 unrouted)
N$18  (2 unrouted)
N$19  (1 unrouted)
N$20
  Top 0.254: 91.47,-25.27 90.2,-26.54 | 91.47,-25.27 92.74,-26.54 | 91.47,-25.27 91.47,-26.54
N$21
  Top 0.254: 92.74,-27.81 91.47,-27.81 90.84,-28.44 | 90.84,-28.44 90.2,-29.08 | 90.2,-27.81 90.84,-28.44 | 90.84,-28.44 91.47,-29.08 92.74,-29.08
N$22  (1 unrouted)
N$23
  Top 0.254: 6.74,-27.46 4.07,-27.46 2.8,-26.2
  Top 0.406: 6.74,-27.46 4.2,-27.46 1.66,-25.05 6.74,-25.05 | 6.74,-28.99 2.93,-28.99 1.66,-27.46 2.8,-26.2
N$24  (2 unrouted)
N$25  (1 unrouted)
N$26
  Top 0.254: 6.74,-22 4.45,-22.13 2.67,-20.86
  Top 0.406: 6.74,-22 4.2,-22 1.66,-19.59 6.74,-19.59 | 6.74,-23.53 2.93,-23.53 1.66,-22 2.67,-20.86
N$27
  Top 0.406: 1.66,-16.04 4.2,-17.81 6.74,-16.29
N$28
  Top 0.406: 6.74,-14.77 5.47,-14.77 | 5.47,-14.77 4.2,-14.77 1.66,-13.49 5.47,-12.22 | 5.47,-12.22 6.74,-12.22 | 5.47,-12.22 5.47,-14.77
N$29  (1 unrouted)
N$30  (1 unrouted)
N$31  (1 unrouted)
N$32  (1 unrouted)
N$33  (1 unrouted)
N$34  (1 unrouted)
N$35  (1 unrouted)
N$36  (1 unrouted)
N$37  (2 unrouted)
N$38  (1 unrouted)
N$39  (1 unrouted)
N$41  (1 unrouted)
N$42  (1 unrouted)
N$44  (via drill 0.51)
  Top 0.254: 54.96,-28.71 57.24,-28.71 v58.77,-27.57
N$45  (1 unrouted)
N$46  (via drill 0.51)
  Top 0.254: 55.09,-29.47 57.37,-29.47 58.13,-29.09 v58.77,-28.84
N$47  (via drill 0.51)
  Top 0.254: 55.21,-30.23 58.01,-30.23 58.26,-29.98 v58.77,-29.98
N$48  (via drill 0.51)
  Top 0.254: 55.34,-31.12 58.01,-31.12 58.13,-30.99 58.64,-30.99 v58.77,-31.12
NRST  (5 unrouted)
PBOUT  (2 unrouted)
PSHOLD  (1 unrouted)
SD_MISO  (2 unrouted)
SD_MOSI  (2 unrouted)
SD_RSV  (1 unrouted)
SD_SCK  (1 unrouted)
SELECT0  (1 unrouted)
SELECT1  (1 unrouted)
SLOPE1  (1 unrouted)
SLOPE2  (1 unrouted)
SW
  pour Top (no thermals): 61.82,-7.12 61.82,-10.67 62.58,-10.67 62.58,-11.94 64.1,-11.94 64.1,-10.93 66.64,-10.93 66.64,-7.12
SYS_JTCK-SWCLK  (1 unrouted)
SYS_JTMS-SWDIO  (1 unrouted)
TFT_BACKLIGHT  (2 unrouted)
TFT_CS  (2 unrouted)
TFT_DC  (2 unrouted)
TFT_MISO  (2 unrouted)
TFT_MOSI  (2 unrouted)
TFT_RESET  (3 unrouted)
TFT_SCK  (2 unrouted)
USB_OTG_HS_DM  (1 unrouted)
USB_OTG_HS_DP  (1 unrouted)
USB_RENUM  (1 unrouted)
VBAT  (10 unrouted)
  pour Top (no thermals): 60.29,-10.67 53.69,-10.67 53.69,-7.12 60.29,-7.12
VCAP1  (1 unrouted)
VCAP1A  (1 unrouted)
VCAP1C  (1 unrouted)
VCAP2  (1 unrouted)
VDD  (3 unrouted)
VUSB  (3 unrouted)

### Text on the board
tPlace: RST | PWR
tNames: 3V3 | GND | nrst | ARM
bNames: canl2 | 5v | canh1 | 3v3 | l1 | h2 | h1 | l2 | miso | 3v3 | backlight | gnd | tft_sck | swdio | tft_mosi | swclk | tft_dc | nrst | tft_reset | tft_cs | vbat | gnd | 3v3 | layerOne 2017 | 3v3 | vbus | gnd | d+ | d- | audio | vusb